# Altium schematic sheet 3V3 Regulator.SchDoc: Power Segment
size 292 x 193 mm; SheetNumber: 2; SheetTotal: 5
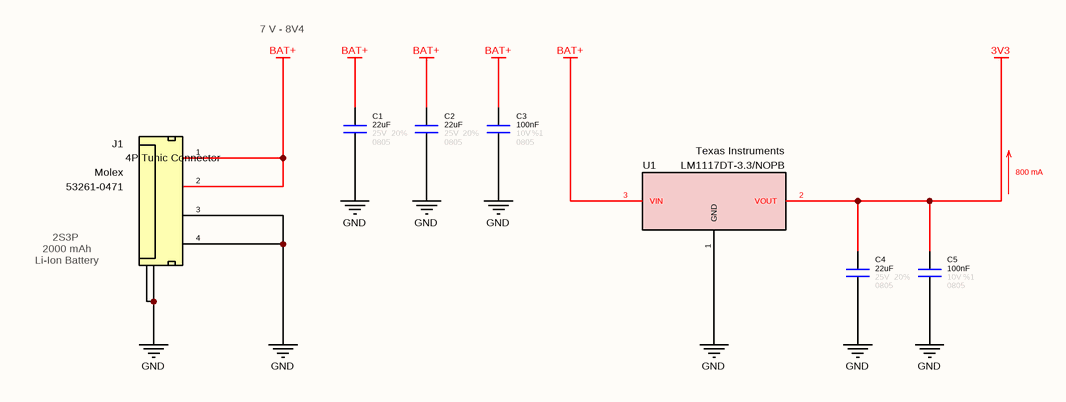
[diagram p0: 3V3 Regulator.SchDoc]

## Parts
C1  value 22uF  Tolerance: 20%  Case: 0805  Voltage: 25V  [CAPACITOR_0805]  (hidden comment: Capacitor - 22uF [1210] (Ceramic))
C2  value 22uF  Tolerance: 20%  Case: 0805  Voltage: 25V  [CAPACITOR_0805]  (hidden comment: Capacitor - 22uF [1210] (Ceramic))
C3  value 100nF  Tolerance: %1  Voltage: 10V  Case: 0805  [CAPACITOR_0805]  (hidden comment: Capacitor - 100nF [0805] (MLCC))
C4  value 22uF  Tolerance: 20%  Case: 0805  Voltage: 25V  [CAPACITOR_0805]  (hidden comment: Capacitor - 22uF [1210] (Ceramic))
C5  value 100nF  Tolerance: %1  Voltage: 10V  Case: 0805  [CAPACITOR_0805]  (hidden comment: Capacitor - 100nF [0805] (MLCC))
J1  Manufacturer Name: Molex  Manufacturer Part Number: 53261-0471  [Connector_Tunic 4P]  (hidden comment: 4P SMD Tunic Connector)
U1  Manufacturer Part Number: LM1117DT-3.3/NOPB  Manufacturer Name: Texas Instruments  [TO-252]  (hidden comment: LDO Regulator)

## Nets
3V3: C4.2 C5.2 U1.2(VOUT)
BAT+: C1.2 C2.2 C3.2 J1.1(BAT+) J1.2(BAT+) U1.3(VIN)
GND: C1.1 C2.1 C3.1 C4.1 C5.1 J1.3(BAT-) J1.4(BAT-) J1.5(GND) J1.6(GND) U1.1(GND)

## Notes on the sheet
- 7 V - 8V4
- 800 mA
- (near J1) 2S3P
  2000 mAh
  Li-Ion Battery
- © 2022 All rights reserved.
  This document may not, in whole or in part, be copied, photocopied, reproduced, translated or converted to any electronic or machine readable from without prior written permission of Mehmet Günce Akkoyun.
  Engineer contact : akkoyun@me.com
- Property of
- Engineer :
- Date :
- Size :
- A4
- Time :
- Project :
- Page :
- /
- Customer :
- Product ID :
- Module ID :
- Version :
- File :
- Revision :
- (in symbol Connector - Mini Tunic 4P (1.25)) 4P Tunic Connector

## Library data of the parts
C1 C2 C4 = Capacitor - 22uF [0805-25V]: Multilayer Ceramic Capacitors MLCC - SMD/SMT 22UF 25V 10% 1210; Manufacturer Part Number: GRM21BR61E226ME44L; Manufacturer Name: Murata
C3 C5 = Capacitor - 100nF [0805-10V]: Capacitor (MLCC) - 100nF / 10V / 0805; Manufacturer Name: KEMET; Manufacturer Part Number: C0805C104K8JACAUTO; Subcategory: Capacitors
J1 = Connector - Mini Tunic 4P (1.25): Mini Tunic Connector with 4P; Pitch: 1.25mm; Position: 4; ROHS: Yes; ComponentLink1Description: DataSheet; ComponentLink1URL: https://www.mouser.com.tr/datasheet/2/276/0532610471_PCB_HEADERS-170942.pdf; ComponentLink2Description: Mouser; ComponentLink2URL: https://www.mouser.com.tr/ProductDetail/Molex/53261-0471?qs=%2Fha2pyFaduhLhIsk8tywtK7BwWtguBSP4XxyDBTOTfs%3D; Case: SMD
U1 = IC - LM1117DT-3.3/NOPB: LDO Voltage Regulators 800MA LDO LINEAR REG; Case: TO-252-3